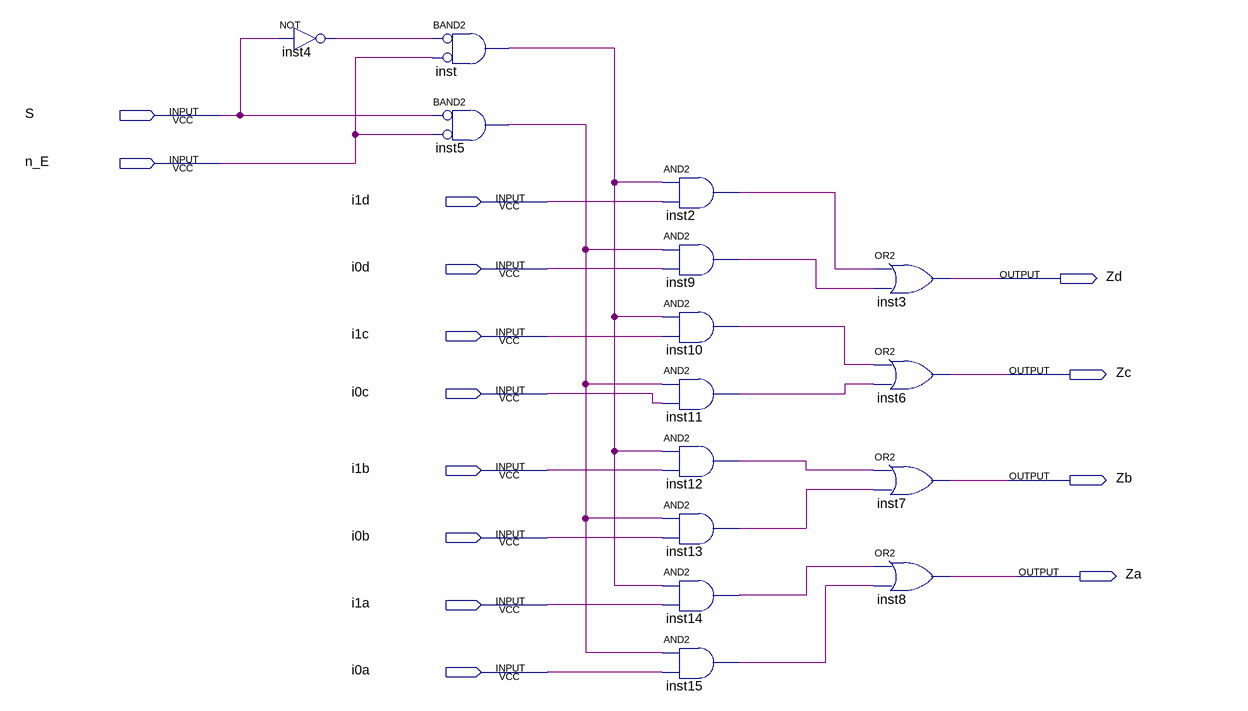
[diagram p0: schematic sheet]
// Quartus schematic ci74157.bdf as structural Verilog: 15 symbols, 14 pins
module ci74157 (
  input  S,
  input  n_E,
  input  i1d,
  input  i0d,
  input  i1c,
  input  i0c,
  input  i1b,
  input  i0b,
  input  i1a,
  input  i0a,
  output Zd,
  output Zc,
  output Zb,
  output Za
);

  wire inst2_out, inst4_out, inst5_out, inst9_out, inst10_out, inst11_out, inst12_out, inst13_out,
       inst14_out, inst15_out, inst_out;

  not inst4 (inst4_out, S);
  and inst (inst_out, ~inst4_out, ~n_E);  // BAND2
  and inst5 (inst5_out, ~S, ~n_E);  // BAND2
  and inst2 (inst2_out, inst_out, i1d);
  and inst9 (inst9_out, inst5_out, i0d);
  and inst10 (inst10_out, inst_out, i1c);
  and inst11 (inst11_out, inst5_out, i0c);
  and inst12 (inst12_out, inst_out, i1b);
  and inst13 (inst13_out, inst5_out, i0b);
  and inst14 (inst14_out, inst_out, i1a);
  and inst15 (inst15_out, inst5_out, i0a);
  or inst3 (Zd, inst2_out, inst9_out);
  or inst6 (Zc, inst10_out, inst11_out);
  or inst7 (Zb, inst12_out, inst13_out);
  or inst8 (Za, inst14_out, inst15_out);
endmodule
